# EAGLE schematic sanguinololu_big_light_no_fdti_chip_routed_v0.4sd_e2_fan2_EEB (EAGLE 7.6.0)
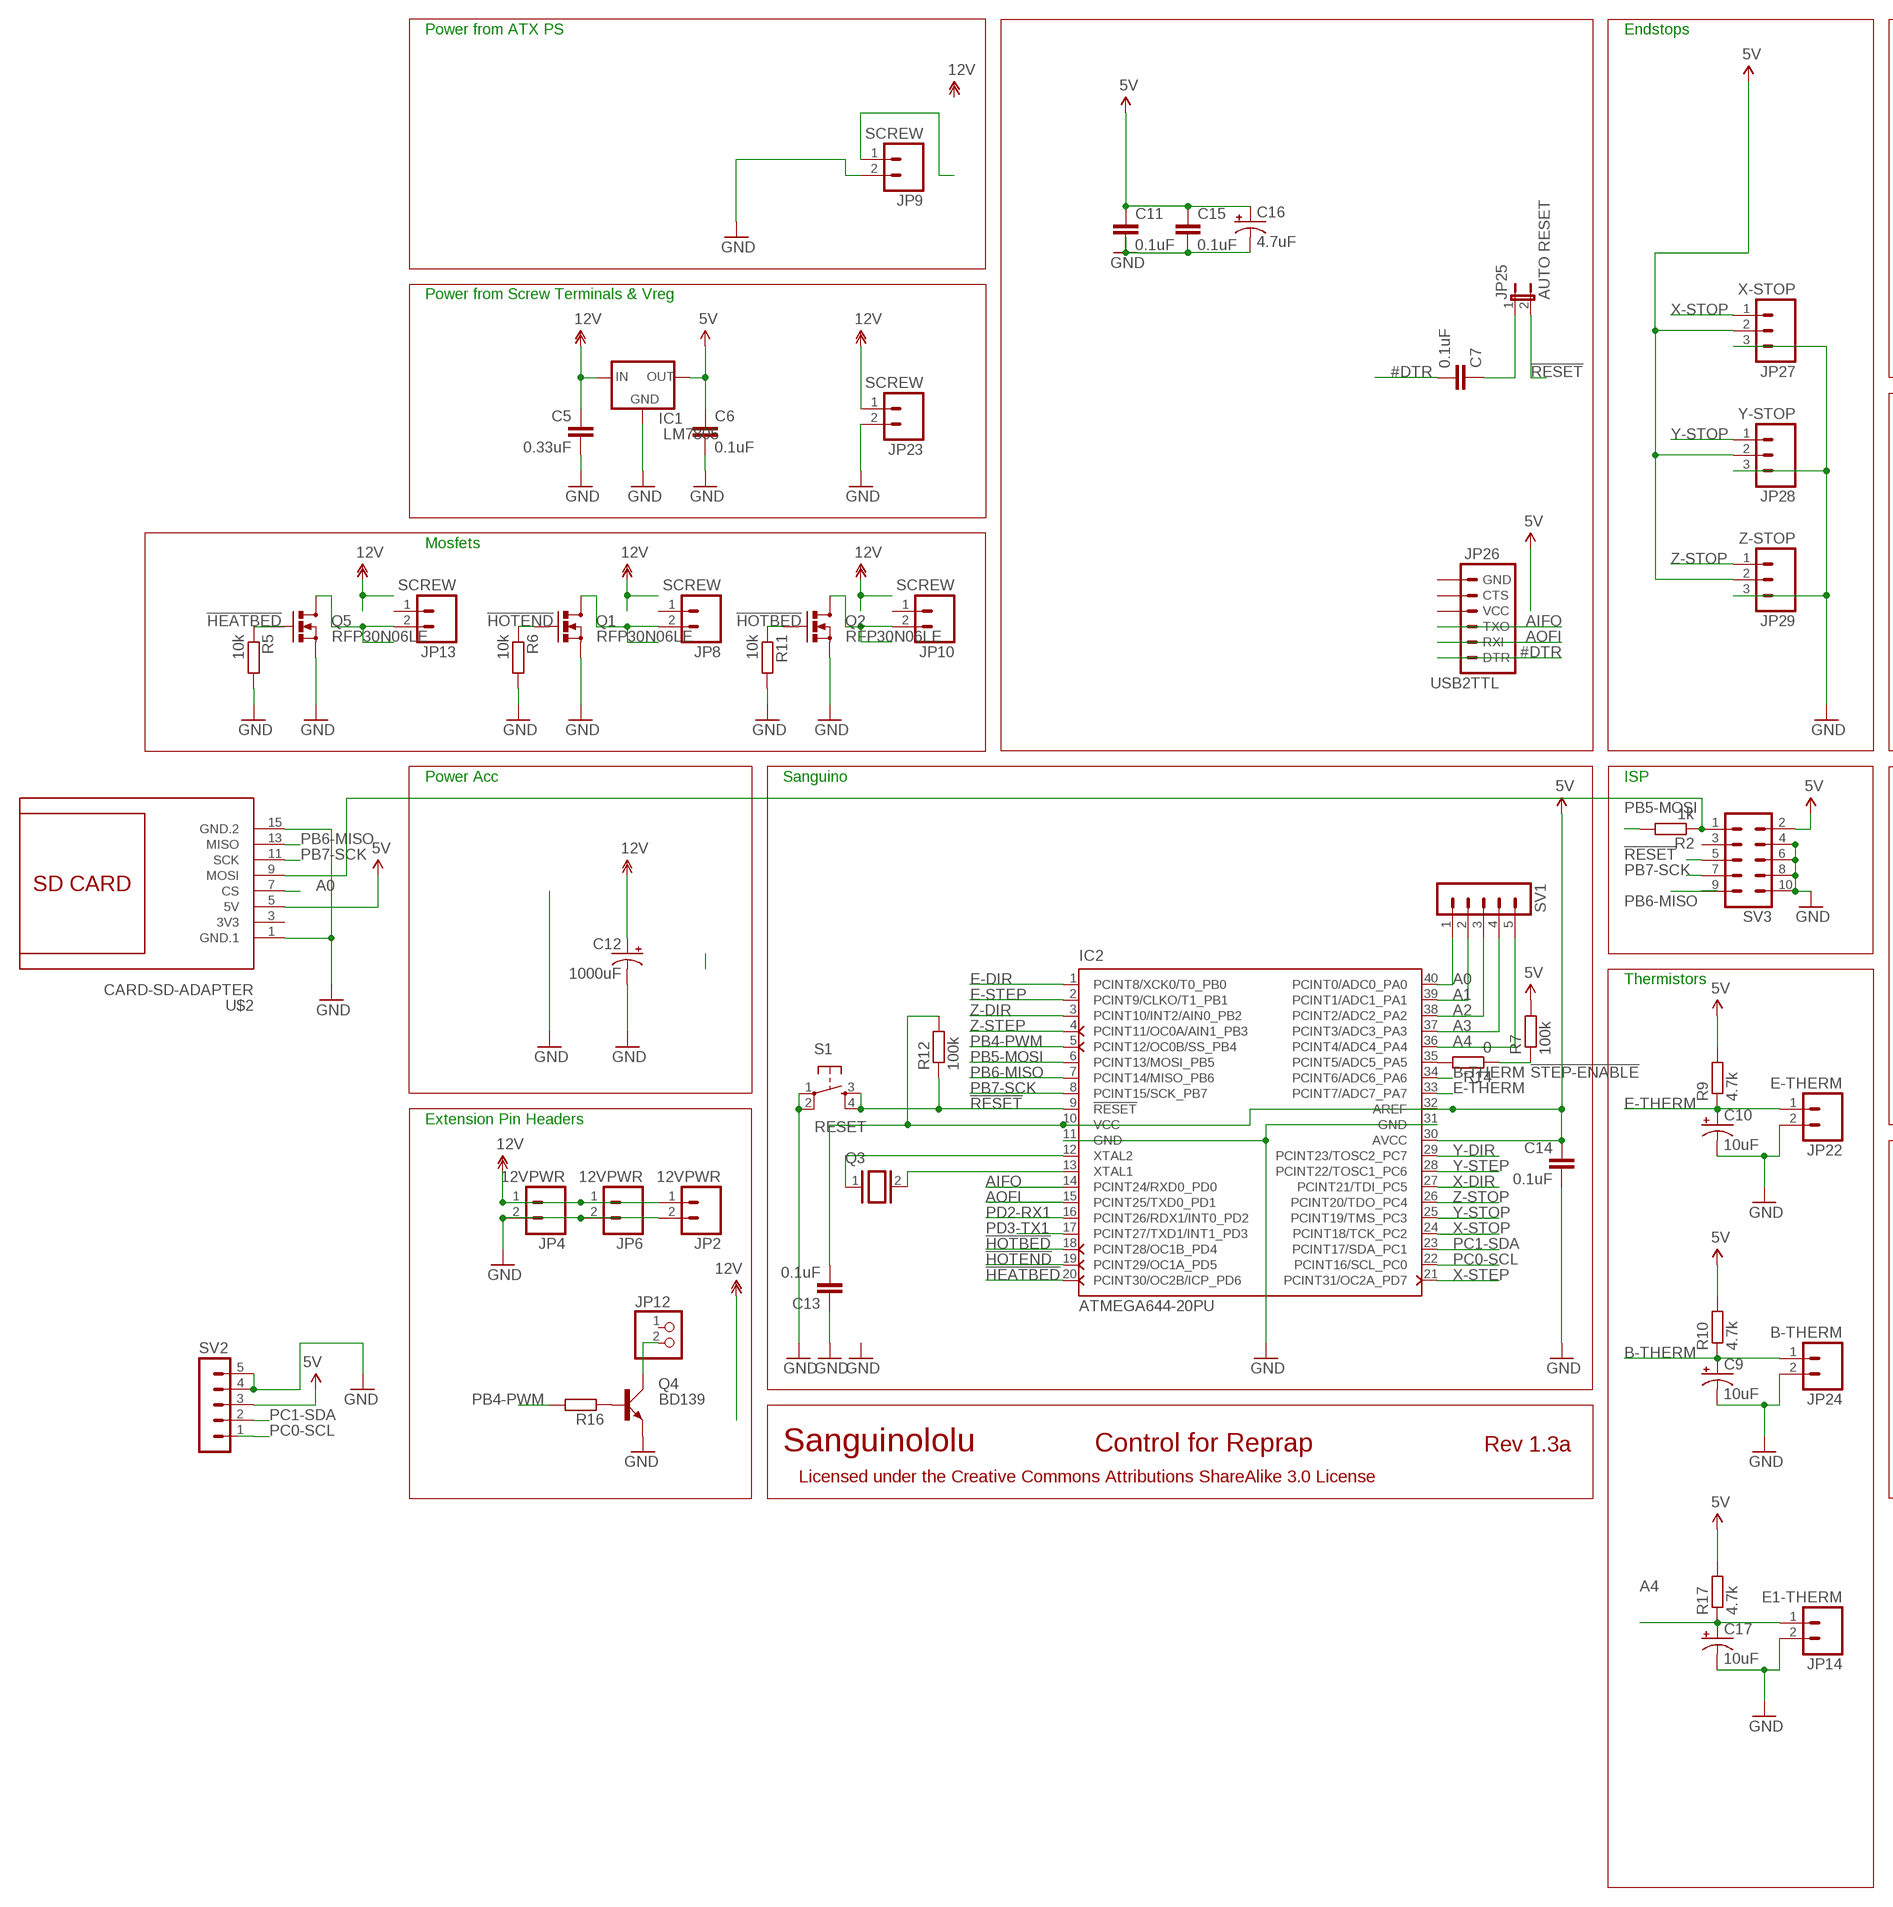
[diagram p0: schematic, sheet 1, part 1 of 2]
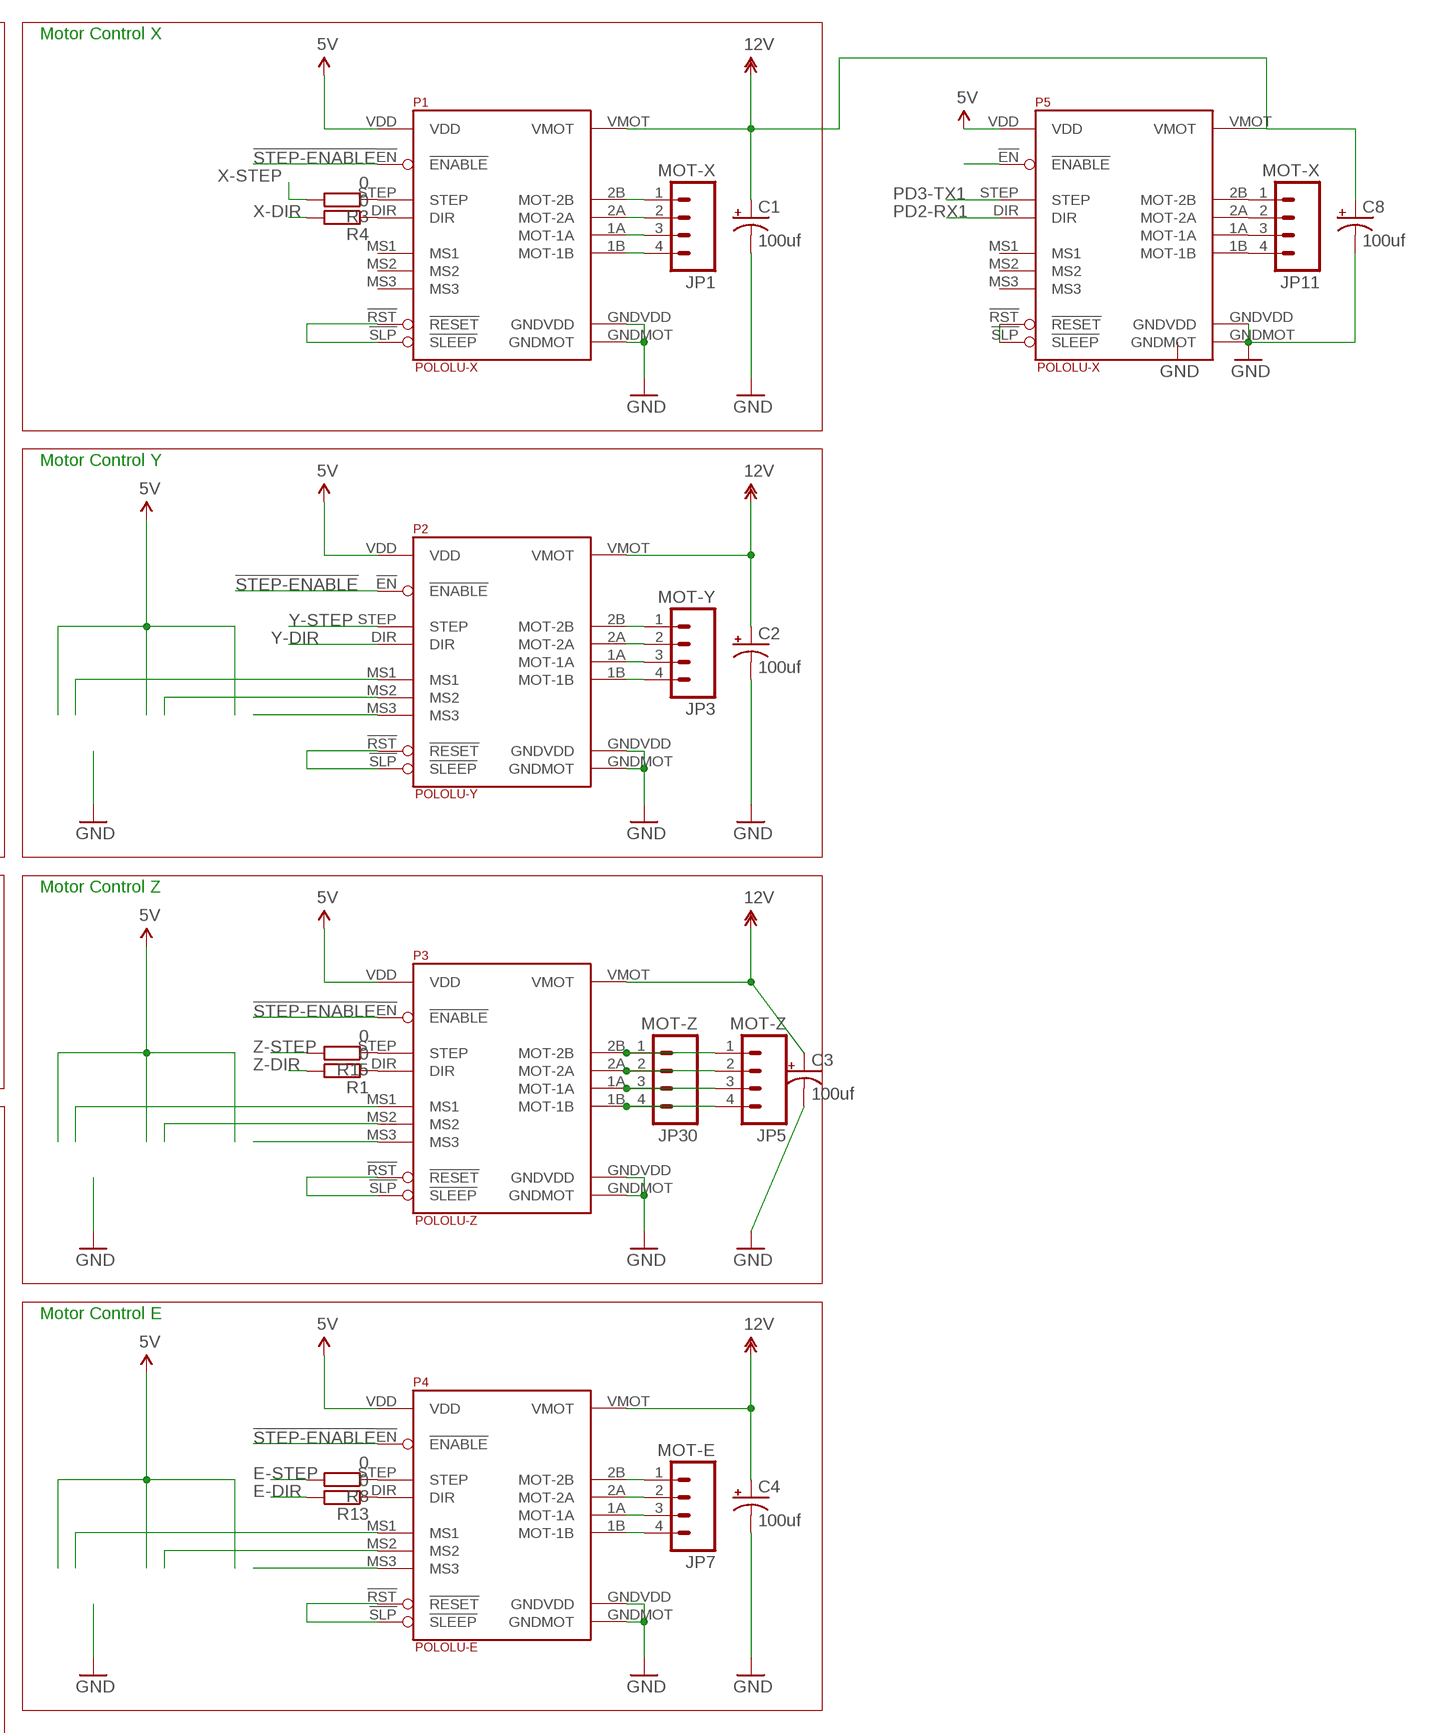
[diagram p1: schematic, sheet 1, part 2 of 2]

## Parts
C1  100uf  CAP_POLPTH1  [CPOL-RADIAL-100UF-25V]
C2  100uf  CAP_POLPTH1  [CPOL-RADIAL-100UF-25V]
C3  100uf  CAP_POLPTH1  [CPOL-RADIAL-100UF-25V]
C4  100uf  CAP_POLPTH1  [CPOL-RADIAL-100UF-25V]
C5  0.33uF  CAPPTH2  [CAP-PTH-SMALL2]
C6  0.1uF  CAPPTH2  [CAP-PTH-SMALL2]
C7  0.1uF  C-EU075-032X103  [C075-032X103]
C8  100uf  CAP_POLPTH1  [CPOL-RADIAL-100UF-25V]
C9  10uF  CAP_POLPTH2  [CPOL-RADIAL-10UF-25V]
C10  10uF  CAP_POLPTH2  [CPOL-RADIAL-10UF-25V]
C11  0.1uF  C5/3  [C5B3]
C12  1000uF  CAP_POLPTH4  [CPOL-RADIAL-1000UF-25V]
C13  0.1uF  CAPPTH2  [CAP-PTH-SMALL2]
C14  0.1uF  CAPPTH2  [CAP-PTH-SMALL2]
C15  0.1uF  C5/3  [C5B3]
C16  4.7uF  CAP_POLPTH2  [CPOL-RADIAL-10UF-25V]
C17  10uF  CAP_POLPTH2  [CPOL-RADIAL-10UF-25V]
IC1  LM7805  V_REG_78XX  [78XXL-CUSTOM]
IC2  ATMEGA644-20PU  [DIL40]
JP1  MOT-X  M04POLAR  [MOLEX-1X4]
JP2  12VPWR  M02POLAR  [MOLEX-1X2]
JP3  MOT-Y  M04POLAR  [MOLEX-1X4]
JP4  12VPWR  M02POLAR  [MOLEX-1X2]
JP5  MOT-Z  M04POLAR  [MOLEX-1X4]
JP6  12VPWR  M02POLAR  [MOLEX-1X2]
JP7  MOT-E  M04POLAR  [MOLEX-1X4]
JP8  SCREW  M025MM  [SCREWTERMINAL-5MM-2]
JP9  SCREW  M025MM  [SCREWTERMINAL-5MM-2]
JP10  SCREW  M025MM  [SCREWTERMINAL-5MM-2]
JP11  MOT-X  M04POLAR  [MOLEX-1X4]
JP12  PINHD-1X2  [1X02]
JP13  SCREW  M025MM  [SCREWTERMINAL-5MM-2]
JP14  E1-THERM  M02PTH  [1X02]
JP22  E-THERM  M02PTH  [1X02]
JP23  SCREW  M025MM  [SCREWTERMINAL-5MM-2]
JP24  B-THERM  M02PTH  [1X02]
JP25  AUTO RESET  JUMPER-2PTH  [1X02]
JP26  USB2TTL  ARDUINO_SERIAL_PROGRAMPTH  [1X06]
JP27  X-STOP  M03POLAR  [MOLEX-1X3]
JP28  Y-STOP  M03POLAR  [MOLEX-1X3]
JP29  Z-STOP  M03POLAR  [MOLEX-1X3]
JP30  MOT-Z  M04POLAR  [MOLEX-1X4]
P1  POLOLU-X  POLOLU-ALLEGRO  [POLOLU-ALLEGRO-PTH]
P2  POLOLU-Y  POLOLU-ALLEGRO  [POLOLU-ALLEGRO-PTH]
P3  POLOLU-Z  POLOLU-ALLEGRO  [POLOLU-ALLEGRO-PTH]
P4  POLOLU-E  POLOLU-ALLEGRO  [POLOLU-ALLEGRO-PTH]
P5  POLOLU-X  POLOLU-ALLEGRO  [POLOLU-ALLEGRO-PTH]
Q1  RFP30N06LE  MOSFET-NCHANNELPTH2  [TO220V]
Q2  RFP30N06LE  MOSFET-NCHANNELPTH2  [TO220V]
Q3  XTAL/S  [QS]
Q4  BD139  [TO126AV]
Q5  RFP30N06LE  MOSFET-NCHANNELPTH2  [TO220V]
R1  0  R-EU_0207/15  [0207/15]
R2  1k  R-EU_0207/15  [0207/15]
R3  0  R-EU_0207/15  [0207/15]
R4  0  R-EU_0207/15  [0207/15]
R5  10k  R-EU_0207/7  [0207/7]
R6  10k  R-EU_0207/7  [0207/7]
R7  100k  R-EU_0207/7  [0207/7]
R8  0  R-EU_0207/15  [0207/15]
R9  4.7k  R-EU_0207/7  [0207/7]
R10  4.7k  R-EU_0207/7  [0207/7]
R11  10k  R-EU_0207/7  [0207/7]
R12  100k  R-EU_0207/7  [0207/7]
R13  0  R-EU_0207/15  [0207/15]
R14  0  R-EU_0207/15  [0207/15]
R15  0  R-EU_0207/15  [0207/15]
R16  R-EU_0204/2V  [0204V]
R17  4.7k  R-EU_0207/7  [0207/7]
S1  RESET  TAC_SWITCHPTH  [TACTILE-PTH]
SV1  MA05-1  [MA05-1]
SV2  MA05-1  [MA05-1]
SV3  MA05-2  [MA05-2]
U$2  CARD-SD-ADAPTER  [CARD-SD-ADAPTER]

## Nets
5V: C6.1 C11.1 C13.2 C14.1 C15.1 C16.1(+) IC1.OUT IC2.10(VCC) IC2.30(AVCC) IC2.32(AREF) JP27.2 JP28.2 JP29.2 P1.VDD P2.VDD P3.VDD P4.VDD P5.VDD R7.2 R9.2 R10.2 R12.2 R17.2 SV2.3 SV3.2 U$2.5(5V)
12V: C1.1(+) C2.1(+) C3.1(+) C4.1(+) C5.1 C8.1(+) C12.1(+) IC1.IN JP2.1 JP4.1 JP6.1 JP23.1 P1.VMOT P2.VMOT P3.VMOT P4.VMOT P5.VMOT
!FTDI-RESET: C7.1 JP25.1
!HEATBED: IC2.20(PCINT30/OC2B/ICP_PD6) Q5.1(G) R5.1
!HOTBED: IC2.18(PCINT28/OC1B_PD4) Q2.1(G) R11.1
!HOTEND: IC2.19(PCINT29/OC1A_PD5) Q1.1(G) R6.1
!RESET: IC2.9(!RESET) JP25.2 R12.1 S1.3 S1.4 SV3.5
!STEP-ENABLE: P1.!EN(!ENABLE) P2.!EN(!ENABLE) P3.!EN(!ENABLE) P4.!EN(!ENABLE) P5.!EN(!ENABLE) R7.1 R14.1
#DTR: C7.2 JP26.1(DTR)
A0: IC2.40(PCINT0/ADC0_PA0) SV1.1 U$2.7(CS)
A1: IC2.39(PCINT1/ADC1_PA1) SV1.2
A2: IC2.38(PCINT2/ADC2_PA2) SV1.3
A3: IC2.37(PCINT3/ADC3_PA3) SV1.4
A4: C17.1(+) IC2.36(PCINT4/ADC4_PA4) JP14.1 R17.1 SV1.5
AIFO: IC2.14(PCINT24/RXD0_PD0) JP26.3(TXO)
AOFI: IC2.15(PCINT25/TXD0_PD1) JP26.2(RXI)
B-THERM: C9.1(+) IC2.34(PCINT6/ADC6_PA6) JP24.1 R10.1
E-DIR: IC2.1(PCINT8/XCK0/T0_PB0) R13.2
E-MOT-1A [power]: JP7.3 P4.1A(MOT-1A)
E-MOT-1B [power]: JP7.4 P4.1B(MOT-1B)
E-MOT-2A [power]: JP7.2 P4.2A(MOT-2A)
E-MOT-2B [power]: JP7.1 P4.2B(MOT-2B)
E-MS1: P4.MS1
E-MS2: P4.MS2
E-MS3: P4.MS3
E-RESETSLEEP: P4.!RST(!RESET) P4.!SLP(!SLEEP)
E-STEP: IC2.2(PCINT9/CLKO/T1_PB1) R8.2
E-THERM: C10.1(+) IC2.33(PCINT7/ADC7_PA7) JP22.1 R9.1
GND [power]: C1.2(-) C2.2(-) C3.2(-) C4.2(-) C5.2 C6.2 C8.2(-) C9.2(-) C10.2(-) C11.2 C12.2(-) C13.1 C14.2 C15.2 C16.2(-) C17.2(-) IC1.GND IC2.11(GND) IC2.31(GND) JP2.2 JP4.2 JP6.2 JP9.2 JP14.2 JP22.2 JP23.2 JP24.2 JP27.3 JP28.3 JP29.3 P1.GNDMOT P1.GNDVDD P2.GNDMOT P2.GNDVDD P3.GNDMOT P3.GNDVDD P4.GNDMOT P4.GNDVDD P5.GNDMOT P5.GNDVDD Q1.3(S) Q2.3(S) Q4.E Q5.3(S) R5.2 R6.2 R11.2 S1.1 S1.2 SV2.4 SV2.5 SV3.4 SV3.6 SV3.8 SV3.10 U$2.1(GND.1) U$2.15(GND.2)
HOTBED-GND [power]: JP10.2 Q2.2(D)
HOTEND-GND [power]: JP8.2 Q1.2(D)
HOTEND-GND1 [power]: JP13.2 Q5.2(D)
N$3: R2.1 SV3.1 U$2.9(MOSI)
N$4: P1.STEP R3.1
N$5: P1.DIR R4.1
N$7: P4.STEP R8.1
N$8: P4.DIR R13.1
N$9: IC2.12(XTAL2) Q3.1
N$10: IC2.13(XTAL1) Q3.2
N$11: IC2.35(PCINT5/ADC5_PA5) R14.2
N$12: P3.DIR R1.1
N$13: P3.STEP R15.1
N$44: JP11.1 P5.2B(MOT-2B)
N$45: JP11.2 P5.2A(MOT-2A)
N$46: JP11.3 P5.1A(MOT-1A)
N$47: JP11.4 P5.1B(MOT-1B)
N$49: P5.!RST(!RESET) P5.!SLP(!SLEEP)
N$50: JP12.2 Q4.C
N$53: Q4.B R16.1
N$220: JP9.1
PB4-PWM: IC2.5(PCINT12/OC0B/SS_PB4) R16.2
PB5-MOSI: IC2.6(PCINT13/MOSI_PB5) R2.2
PB6-MISO: IC2.7(PCINT14/MISO_PB6) SV3.9 U$2.13(MISO)
PB7-SCK: IC2.8(PCINT15/SCK_PB7) SV3.7 U$2.11(SCK)
PC0-SCL: IC2.22(PCINT16/SCL_PC0) SV2.1
PC1-SDA: IC2.23(PCINT17/SDA_PC1) SV2.2
PD2-RX1: IC2.16(PCINT26/RDX1/INT0_PD2) P5.DIR
PD3-TX1: IC2.17(PCINT27/TXD1/INT1_PD3) P5.STEP
X-DIR: IC2.27(PCINT21/TDI_PC5) R4.2
X-MOT-1A [power]: JP1.3 P1.1A(MOT-1A)
X-MOT-1B [power]: JP1.4 P1.1B(MOT-1B)
X-MOT-2A [power]: JP1.2 P1.2A(MOT-2A)
X-MOT-2B [power]: JP1.1 P1.2B(MOT-2B)
X-RESETSLEEP: P1.!RST(!RESET) P1.!SLP(!SLEEP)
X-STEP: IC2.21(PCINT31/OC2A_PD7) R3.2
X-STOP: IC2.24(PCINT18/TCK_PC2) JP27.1
Y-DIR: IC2.29(PCINT23/TOSC2_PC7) P2.DIR
Y-MOT-1A [power]: JP3.3 P2.1A(MOT-1A)
Y-MOT-1B [power]: JP3.4 P2.1B(MOT-1B)
Y-MOT-2A [power]: JP3.2 P2.2A(MOT-2A)
Y-MOT-2B [power]: JP3.1 P2.2B(MOT-2B)
Y-MS1: P2.MS1
Y-MS2: P2.MS2
Y-MS3: P2.MS3
Y-RESETSLEEP: P2.!RST(!RESET) P2.!SLP(!SLEEP)
Y-STEP: IC2.28(PCINT22/TOSC1_PC6) P2.STEP
Y-STOP: IC2.25(PCINT19/TMS_PC3) JP28.1
Z-DIR: IC2.3(PCINT10/INT2/AIN0_PB2) R1.2
Z-MOT-1A [power]: JP5.3 JP30.3 P3.1A(MOT-1A)
Z-MOT-1B [power]: JP5.4 JP30.4 P3.1B(MOT-1B)
Z-MOT-2A [power]: JP5.2 JP30.2 P3.2A(MOT-2A)
Z-MOT-2B [power]: JP5.1 JP30.1 P3.2B(MOT-2B)
Z-MS1: P3.MS1
Z-MS2: P3.MS2
Z-MS3: P3.MS3
Z-RESETSLEEP: P3.!RST(!RESET) P3.!SLP(!SLEEP)
Z-STEP: IC2.4(PCINT11/OC0A/AIN1_PB3) R15.2
Z-STOP: IC2.26(PCINT20/TDO_PC4) JP29.1
Unconnected: JP8.1 JP10.1 JP12.1 JP13.1 JP26.4(VCC) JP26.5(CTS) JP26.6(GND) P1.MS1 P1.MS2 P1.MS3 P5.MS1 P5.MS2 P5.MS3 SV3.3

## Notes on the sheet
- Power from ATX PS | Endstops | Motor Control X
- Power from Screw Terminals & Vreg
- Motor Control Y
- Mosfets
- Power Acc | Sanguino | ISP | Motor Control Z
- Thermistors
- Extension Pin Headers
- Motor Control E
- Sanguinololu | Control for Reprap | Rev 1.3a
- Licensed under the Creative Commons Attributions ShareAlike 3.0 License

## Power pins joined to a net without a drawn wire
3V3: U$2.3(3V3)

## Library data of the parts
C1-C4 C8-C10 C12 C16 C17 = SparkFun:CAP_POL: Capacitor Polarized These are standard SMD and PTH capacitors. Normally 10uF, 47uF, and 100uF in electrolytic and tantalum varieties. Always verify the external diameter of the through hole cap, it varies with capacity, voltage, and manufacturer. The EIA devices should be standard.
C5 C6 C13 C14 = SparkFun:CAP: Capacitor Standard 0603 ceramic capacitor, and 0.1" leaded capacitor.
C7 = rcl:C-EU: CAPACITOR, European symbol
C11 C15 = capacitor-wima:C: CAPACITOR naming: grid - package width
IC1 = SparkFun:V_REG_78XX: Voltage Regulator Standard 7805 5V regulator. IGO (Input Ground Output). Spark Fun Electronics SKU : COM-00107
IC2 = atmel:ATMEGA644-*PU: 8-bit Microcontroller with 64K Bytes In-System Programmable Flash Auto generated by make-symbol-device-package-bsdl.ulp Rev. 34 Source: http://www.atmel.com/dyn/resources/prod_documents/doc2593.pdf; MPN: ATMEGA644-20PU; OC_FARNELL: 1288340; OC_NEWARK: 23M5060
JP1 JP3 JP5 JP7 JP11 JP30 = SparkFun:M04: Header 4 Standard 4-pin 0.1" header. Use with straight break away headers (SKU : PRT-00116), right angle break away headers (PRT-00553), swiss pins (PRT-00743), machine pins (PRT-00117), and female headers (PRT-00115). Molex polarized connector foot print use with SKU : PRT-08231 with associated crimp pins and housings.
JP2 JP4 JP6 JP8-JP10 JP13 JP14 JP22-JP24 = SparkFun:M02: Header 2 Standard 2-pin 0.1" header. Use with straight break away headers (SKU : PRT-00116), right angle break away headers (PRT-00553), swiss pins (PRT-00743), machine pins (PRT-00117), and female headers (PRT-00115). Molex polarized connector foot print use with SKU : PRT-08233 with associated crimp pins and housings.
JP12 = pinhead:PINHD-1X2: PIN HEADER
JP25 = SparkFun:JUMPER-2: Jumper Basic 0.1" spaced jumper. Use with breakaway headers.
JP26 = SparkFun:ARDUINO_SERIAL_PROGRAM
JP27-JP29 = SparkFun:M03: Header 3 Standard 3-pin 0.1" header. Use with straight break away headers (SKU : PRT-00116), right angle break away headers (PRT-00553), swiss pins (PRT-00743), machine pins (PRT-00117), and female headers (PRT-00115). Molex polarized connector foot print use with SKU : PRT-08232 with associated crimp pins and housings.
P1-P5 = pololu-allegro:POLOLU-ALLEGRO
Q1 Q2 Q5 = SparkFun:MOSFET-NCHANNEL
Q3 = special:XTAL/S: CRYSTAL
Q4 = transistor-power:BD139: NPN TRANSISTOR
R1-R4 R8 R13-R15 = rcl:R-EU_: RESISTOR, European symbol
R5-R7 R9-R12 R17 = rcl_bigpad:R-EU_: RESISTOR, European symbol
R16 = resistor:R-EU_: RESISTOR, European symbol
S1 = SparkFun:TAC_SWITCH: Momentary Switch Button commonly used for reset or general input. Spark Fun Electronics SKU : COM-00097
SV1 SV2 = con-lstb:MA05-1: PIN HEADER; OC_FARNELL: unknown; OC_NEWARK: unknown
SV3 = con-lstb:MA05-2: PIN HEADER; OC_FARNELL: unknown; OC_NEWARK: unknown
U$2 = sd_adapter_full:CARD-SD-ADAPTER: Full Size SD Card Adapter Module with onboard 3.3V regulator Guide describing how to use SD card with Arduino is available here: https://www.arduino.cc/en/Reference/SDCardNotes Click here to find device on ebay.com <http://www.ebay.com/sch/sd+card+socket+module>